# Altium schematic sheet DDS.SchDoc: **
size A4; Author: **; CompanyName: Introducción al Diseño de Circuitos Impresos; Organization: UTN FRBA; Revision: **
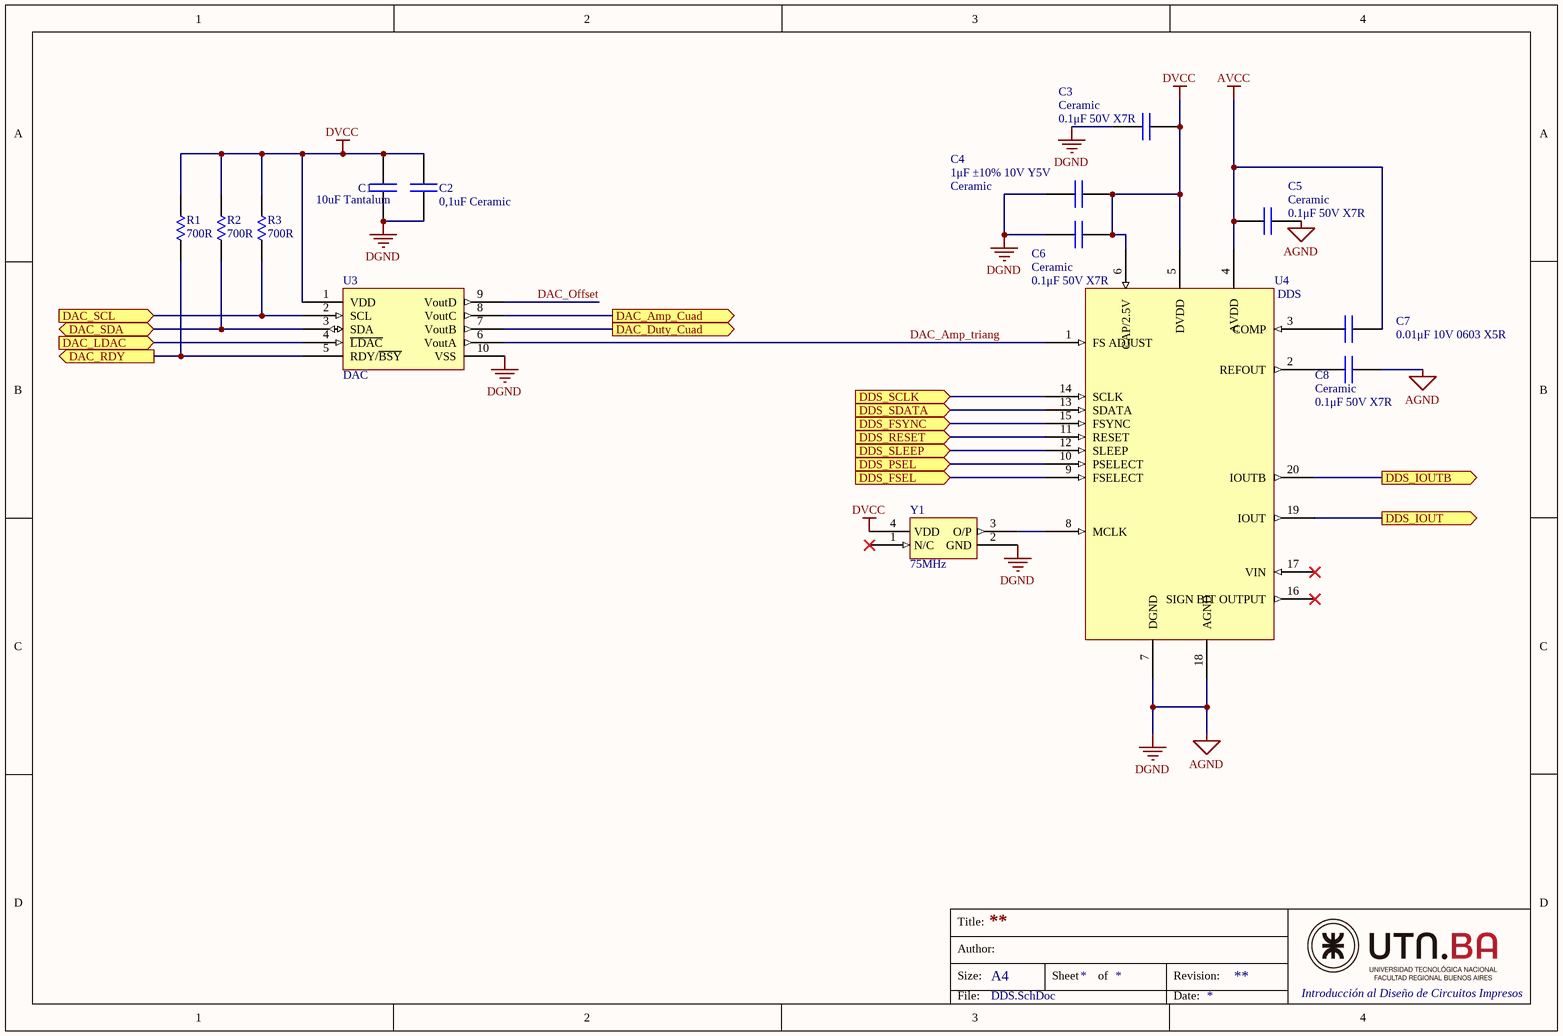
[diagram p0: DDS.SchDoc]

## Parts
C1  10uF Tantalum
C2  0,1uF Ceramic
C3  0.1μF 50V X7R  Type: Ceramic
C4  1μF ±10% 10V Y5V  Type: Ceramic
C5  0.1μF 50V X7R  Type: Ceramic
C6  0.1μF 50V X7R  Type: Ceramic
C7  0.01μF 10V 0603 X5R
C8  0.1μF 50V X7R  Type: Ceramic
R1  700R
R2  700R
R3  700R
U3  DAC
U4  DDS
Y1  75MHz

## Ports
DAC_Amp_Cuad (out), DAC_Duty_Cuad (out), DAC_LDAC (in), DAC_RDY (out), DAC_SCL (in), DAC_SDA (bidir), DDS_FSEL (in), DDS_FSYNC (in), DDS_IOUT (out), DDS_IOUTB (out), DDS_PSEL (in), DDS_RESET (in), DDS_SCLK (in), DDS_SDATA (in), DDS_SLEEP (in)

## Nets
AGND: C1.2 C2.2 C3.1 C4.1 C5.2 C6.1 C8.2 U3.10(VSS) U4.7(DGND) U4.18(AGND) Y1.2(GND)  [also labelled DGND]
AVCC: C5.1 C7.1 U4.4(AVDD)
DVCC: C1.1 C2.1 C3.2 C4.2 C6.2 R1.2 R2.2 R3.2 U3.1(VDD) U4.5(DVDD) U4.6(CAP/2.5V) Y1.4(VDD)
DAC_Amp_Cuad: U3.8(VoutC) ; port DAC_Amp_Cuad
DAC_Amp_triang: U3.6(VoutA) U4.1(FS_ADJUST)
DAC_Duty_Cuad: U3.7(VoutB) ; port DAC_Duty_Cuad
DAC_LDAC: U3.4(~{LDAC}) ; port DAC_LDAC
DAC_Offset: U3.9(VoutD)
DAC_RDY: R1.1 U3.5(RDY/~{BSY}) ; port DAC_RDY
DAC_SCL: R3.1 U3.2(SCL) ; port DAC_SCL
DAC_SDA: R2.1 U3.3(SDA) ; port DAC_SDA
DDS_FSEL: U4.9(FSELECT) ; port DDS_FSEL
DDS_FSYNC: U4.15(FSYNC) ; port DDS_FSYNC
DDS_IOUT: U4.19(IOUT) ; port DDS_IOUT
DDS_IOUTB: U4.20(IOUTB) ; port DDS_IOUTB
DDS_PSEL: U4.10(PSELECT) ; port DDS_PSEL
DDS_RESET: U4.11(RESET) ; port DDS_RESET
DDS_SCLK: U4.14(SCLK) ; port DDS_SCLK
DDS_SDATA: U4.13(SDATA) ; port DDS_SDATA
DDS_SLEEP: U4.12(SLEEP) ; port DDS_SLEEP
NetC7_2: C7.2 U4.3(COMP)
NetC8_1: C8.1 U4.2(REFOUT)
NetU4_8: U4.8(MCLK) Y1.3(O/P)

Not connected (* = marked no-connect by the designer): U4 16(SIGN_BIT_OUTPUT)* 17(VIN)*; Y1 1(N/C)*

## Notes on the sheet
- Title:
- Size:
- Author:
- A4
- Sheet
- of
- Revision:
- File:
- Date:

## Library data of the parts
C1-C8 = Cap: Capacitor
R1-R3 = Res: Resistor
U3 = DAC: DAC x4 I2C
U4 = DDS: DDS 50MHz
Y1 = XTAL: Crystal oscillator